# Altium schematic sheet FEEL_2021_MCU.SchDoc
size A4; SheetNumber: 3; SheetTotal: 5
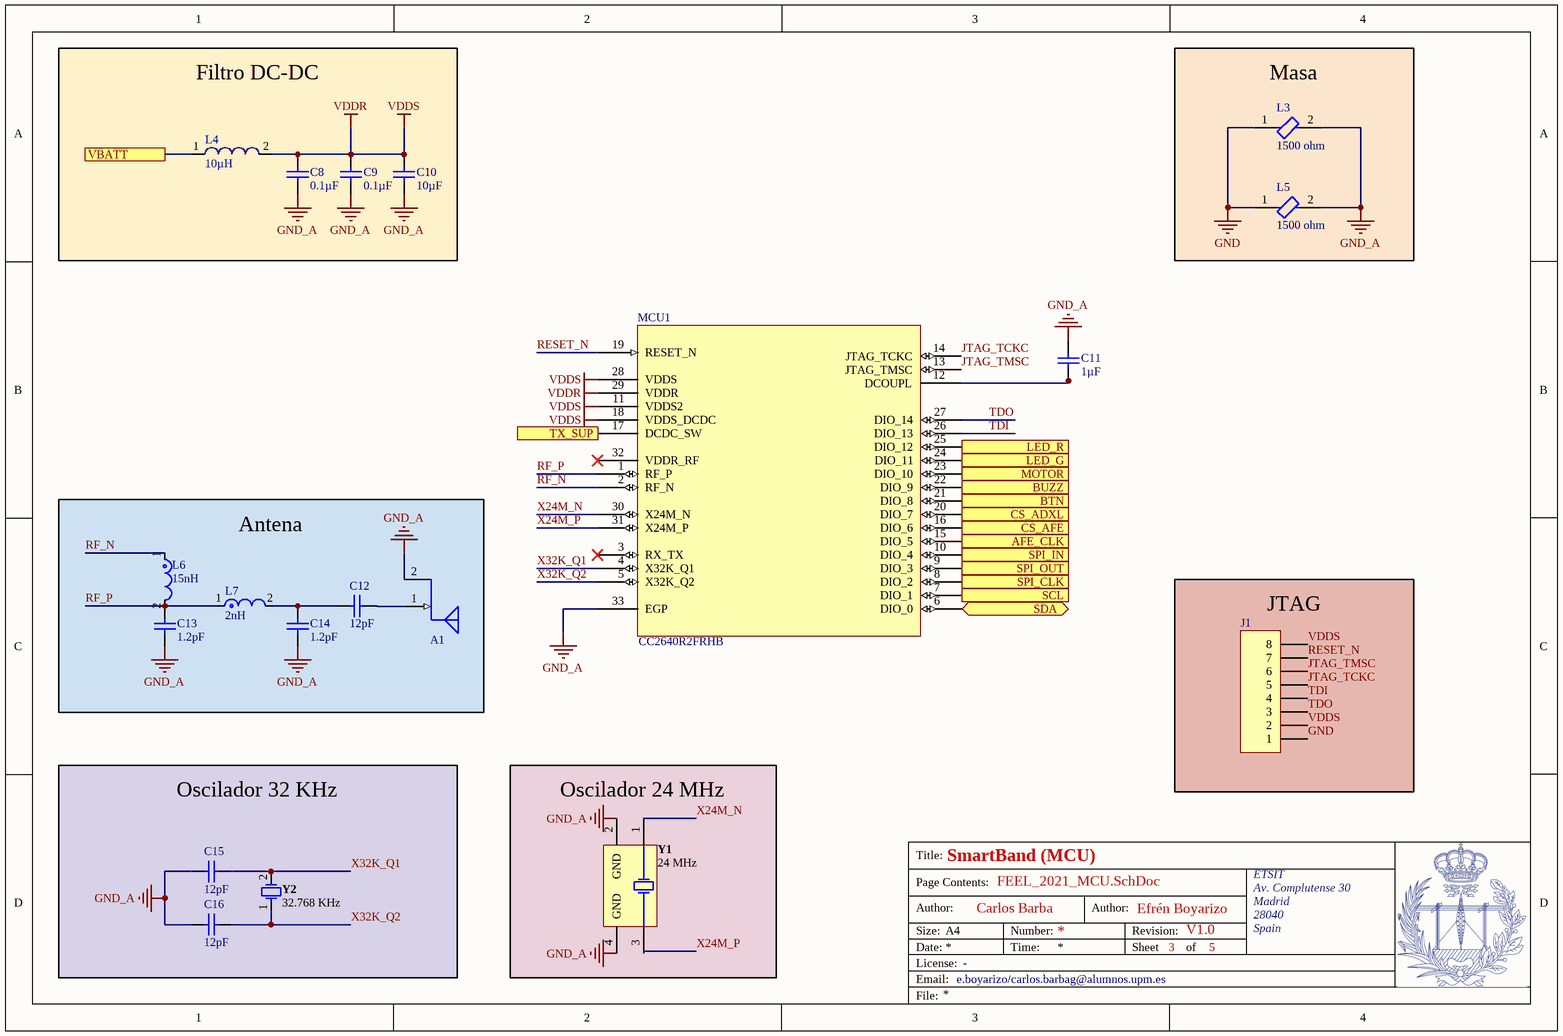
[diagram p0: FEEL_2021_MCU.SchDoc]

## Parts
A1  -  [PCBAntenna]  (value not drawn)  (net tie, no BOM)
C8  0.1µF  [CAPC1608X90X35ML10T15]
C9  0.1µF  [CAPC1608X90X35ML10T15]
C10  10µF  [CAPC1608X90X35ML10T15]
C11  1µF  [CAPC1608X90X35ML10T15]
C12  12pF  [CAPC1608X90X35ML10T15]
C13  1.2pF  [CAPC1608X90X35ML10T15]
C14  1.2pF  [CAPC1608X90X35ML10T15]
C15  12pF  [CAPC1608X90X35ML10T15]
C16  12pF  [CAPC1608X90X35ML10T15]
J1  (no value)  [HDR1X8]
L3  1500 ohm  [FP-BLM18-0_15-t0_8-MFG]
L4  10µH  [SMD 2510]
L5  1500 ohm  [FP-BLM18-0_15-t0_8-MFG]
L6  15nH  [FP-LQG15HH_02-IPC_B]
L7  2nH  [FP-LQG15HH_02-IPC_B]
MCU1  (no value)  [DEOP2021-Calle-Payno]
Y1  24 MHz  [ABRA-ABM3B-4_V]
Y2  32.768 KHz  [ABRA-ABS07_A_V]

## Ports
AFE_CLK (out), BTN (in), BUZZ (out), CS_ADXL (out), CS_AFE (out), LED_G (out), LED_R (out), MOTOR (out), SCL (out), SDA (bidir), SPI_CLK (out), SPI_IN (in), SPI_OUT (out), TX_SUP, VBATT

## Nets
GND: J1.1 L3.1 L5.1
GND_A: A1.2(GND) C8.1 C9.1 C10.1 C11.2 C13.1 C14.1 C15.1 C16.1 L3.2 L5.2 MCU1.33(EGP) Y1.2(GND) Y1.4(GND)
VDDS: C8.2 C9.2 C10.2 J1.2 J1.8 L4.2 MCU1.11(VDDS2) MCU1.18(VDDS_DCDC) MCU1.28(VDDS) MCU1.29(VDDR)  [also labelled VDDR]
AFE_CLK: MCU1.15(DIO_5) ; port AFE_CLK
BTN: MCU1.21(DIO_8) ; port BTN
BUZZ: MCU1.22(DIO_9) ; port BUZZ
CS_ADXL: MCU1.20(DIO_7) ; port CS_ADXL
CS_AFE: MCU1.16(DIO_6) ; port CS_AFE
JTAG_TCKC: J1.5 MCU1.14(JTAG_TCKC)
JTAG_TMSC: J1.6 MCU1.13(JTAG_TMSC)
LED_G: MCU1.24(DIO_11) ; port LED_G
LED_R: MCU1.25(DIO_12) ; port LED_R
MOTOR: MCU1.23(DIO_10) ; port MOTOR
RESET_N: J1.7 MCU1.19(RESET_N)
RF_N: L6.1 MCU1.2(RF_N)
RF_P: C13.2 L6.2 L7.1 MCU1.1(RF_P)
SCL: MCU1.7(DIO_1) ; port SCL
SDA: MCU1.6(DIO_0) ; port SDA
SPI_CLK: MCU1.8(DIO_2) ; port SPI_CLK
SPI_IN: MCU1.10(DIO_4) ; port SPI_IN
SPI_OUT: MCU1.9(DIO_3) ; port SPI_OUT
TDI: J1.4 MCU1.26(DIO_13)
TDO: J1.3 MCU1.27(DIO_14)
TX_SUP: MCU1.17(DCDC_SW) ; port TX_SUP
VBATT: L4.1 ; port VBATT
X24M_N: MCU1.30(X24M_N) Y1.1(X1)
X24M_P: MCU1.31(X24M_P) Y1.3(X2)
X32K_Q1: C15.2 MCU1.4(X32K_Q1) Y2.2
X32K_Q2: C16.2 MCU1.5(X32K_Q2) Y2.1
NetA1_1: A1.1(FeedPoint) C12.2
NetC11_1: C11.1 MCU1.12(DCOUPL)
NetC12_1: C12.1 C14.2 L7.2

Not connected (* = marked no-connect by the designer): MCU1 3(RX_TX)* 32(VDDR_RF)*

## Notes on the sheet
- Filtro DC-DC
- Masa
- Antena
- (near J1) JTAG
- Title:
- SmartBand (MCU)
- Author:
- Page Contents:
- Carlos Barba
- Efrén Boyarizo
- V1.0
- ETSIT
- Av. Complutense 30
- Madrid
- 28040
- Oscilador 32 KHz
- (near Y1) Oscilador 24 MHz
- Size:
- Date:
- File:
- License:
- Email:
- A4
- e.boyarizo/carlos.barbag@alumnos.upm.es
- -
- Number:
- Time:
- Revision:
- Sheet
- of
- 5
- Spain

## Library data of the parts
A1 = PCBAntenna: GND pin has a via to a GND plane that is not included in the footprint, but has to be included in the final PCB layout design.
C8-C16 = CMP-2000-04945-1: Chip Capacitor, 22 pF, +/- 5%, 50 V, -55 to 125 degC, 0603 (1608 Metric), RoHS, Tape and Reel; Manufacturer: Murata; Capacitance: 22pF; Rated Voltage: 50V; Dielectric: C0G; Manufacturer URL: http://www.murata.com/; Datasheet Version: Jul-06; Package Reference: 603; Tolerance (%): ±5%; Case Size/Dimension: 0603; Package Description: 2-Pin Surface Mount Device, Body 1.6 x 0.8 mm; Datasheet URL: https://datasheet.ciiva.com/11786/0900766b807a1cab-11786398.pdf
J1 = Header 8: Header, 8-Pin; LatestRevisionDate: 17-Jul-2002; LatestRevisionNote: Re-released for DXP Platform.; Publisher: Altium Limited
L3 L5 = CMP-0686-00354-3: Chip Ferrite Bead, 0603, 600Ω @ 100MHz, 0.35Ω, 25%, 500mA; Manufacturer Series: BLM18E; Number of Lines: 1; DC Resistance (DCR): 350mR; Impedance: 600R; Material: Steel; Shielding: Unshielded; Package Quantity: 1; Case/Package: 0603; Length: 1.6mm; Packaging: Tape and Reel; Resistance: 350mR; REACH SVHC: No SVHC; Military Standard: Not; Contact Plating: Tin; Termination: SMD/SMT; Number of Circuits: 1; Width: 0.8mm; Test Frequency: 100MHz; DC Current: 500mA; Case Code (Metric): 1608; Max DC Current: 500mA; Max Operating Temperature: 125°C; Current Rating: 500mA; Series: BLM18E; Tolerance: 25%; Min Operating Temperature: -55°C; Frequency: 100MHz; Lead Free: Lead Free; Terminal Finish: Tin; Number of Pins: 2; Max Current Rating: 500mA; Radiation Hardening: No; Case Code (Imperial): 0603; Number of Functions: 1; Depth: 0.8mm; DC Resistance-Max: 350mR; Height: 0.8mm; Core Material: Ferrite; RoHS Compliant: Yes
L4 = CMP-1411-00017-1: Power Multilayer Inductor WE-MAPI, L=10.0µH; PartNumber: 74438323100; Manufacturer: Wuerth Elektronik; Inductance: 10.0ÂµH; ComponentLink1URL: http://www.we-online.com; ComponentLink2Description: Datasheet; ComponentLink1Description: Manufacturer URL; PackageReference: SMD 2510; ComponentLink2URL: http://katalog.we-online.de/kataloge/eisos/media/pdf/74438323100.pdf
L6 L7 = CMP-06042-001992-1: Multilayer type RF Inductor 2.4nH ±0.3nH 0.1Ω 800mA 0402; Current Rating: 300mA; Core Material: Air; Test Frequency: 100MHz; Q Factor: 8; Tolerance: 5%; Shielding: Unshielded; Self Resonant Frequency: 6GHz; DC Resistance (DCR): 160mR; Termination: SMD/SMT; Case Code (Metric): 1005; Current: 300mA; Inductance: 2.4nH; Min Operating Temperature: -55°C; Case/Package: 0402; Height - Seated (Max): 0.022inch; Length: 1mm; REACH SVHC: No SVHC; Case Code (Imperial): 0402; Package Quantity: 10000; Max DC Current: 300mA; DC Current: 300mA; Lead Free: Lead Free; Packaging: Tape and Reel; Width: 0.5mm; Height: 0.5mm; Mount: Surface Mount; Max Operating Temperature: 125°C; Military Standard: Not; Number of Pins: 2; Depth: 0.55mm; Radiation Hardening: No
MCU1 = CC2640R2FRHB
Y1 = CMP-1688-00008-1: Ceramic SMD Crystal, 24 MHz, +/- 20 ppm, 50 Ohm, -20 to 70 degC, 4-Pin SMD, RoHS, Tape and Reel; Impedance: 50 Ohm; Mating Cycles: 30; Frequency: 6 Hz; Contact Material: Brass; Contact Plating: Gold; PackageReference: ABM3B; Min Operating Temperature: -40 degC; ComponentLink2Description: Datasheet; Radiation Hardening: No; DatasheetVersion: Aug-15; Packaging: Tape and Reel; Length: 2.6 mm; Package Quantity: 2500; REACH SVHC: Unknown; PackageDescription: 4-Pin Surface Mount Device, Body 5 x 3.2 mm; Weight: 0.001058 oz; ComponentLink2URL: http://www.abracon.com/Resonators/abm3b.pdf; ComponentLink1Description: Manufacturer URL; Width: 3 mm; RoHSCompliant: true; Fastening Type: Snap; Max Operating Temperature: 155 degC; ComponentLink1URL: http://www.abracon.com/; Height: 1.244 mm; Mount: Surface Mount
Y2 = CMP-2000-07587-1: Tuning Fork Crystal, 32.768 KHz, +/- 20 ppm, -40 to 85 degC, 2-Pin SMD, RoHS, Tape and Reel; Manufacturer: Abracon; Case\/Package: SMD/SMT; Series Resistance: 60KOhm; Frequency Tolerance: 20ppm; Load Capacitance: 6pF; ESR (Equivalent Series Resistance): 55KOhm; Max Operating Temperature: 85degC; Width: 0.061inch; Radiation Hardening: No; Lead Free: LeadFree; RoHSCompliant: True; Depth: 1.5mm; Datasheet URL: http://www.abracon.com/Resonators/ABS07-120-32.768kHz-T.pdf; Frequency: 32.768KHz; Termination: SMD/SMT; Manufacturer URL: http://www.abracon.com/; Package Quantity: 3000; Packaging: TapeandReel; Number of Pins: 2; Height: 0.035inch; Package Description: 2-Pin Surface Mount Device, Body 3.2 x 1.5 mm; Package Reference: ABS07; Mount: SurfaceMount; Tolerance: 20ppm; Mounting Technology: SurfaceMount; REACH SVHC: NoSVHC; Datasheet Version: 11/2014; Length: 3.2mm; Min Operating Temperature: -40degC